# Altium project SerreVo_multiplexeur.PrjPcb
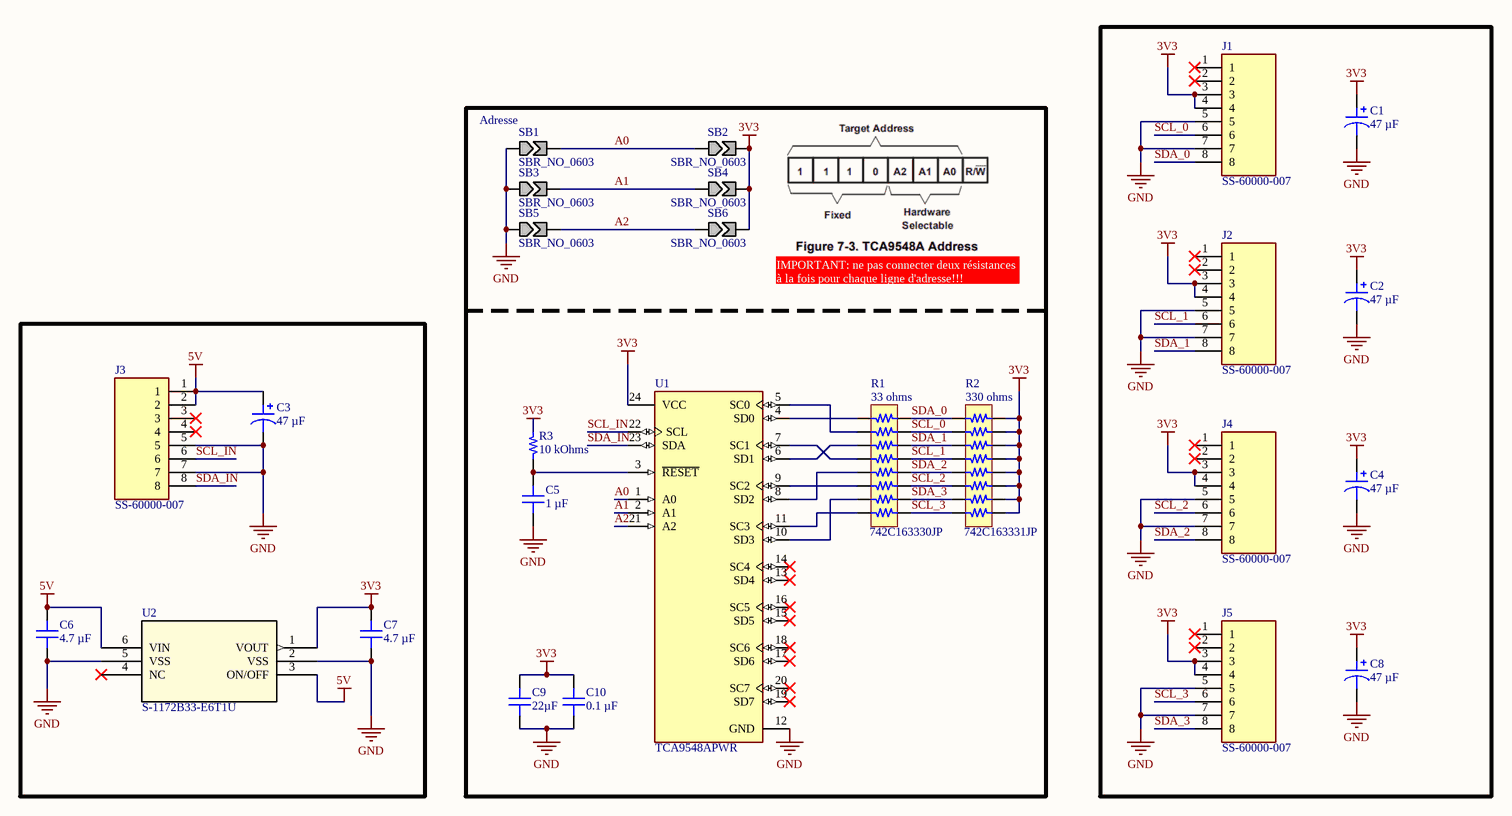
[diagram p0: TEMPLATE_Circuit.SchDoc]
Projet_Titre: SerrVo_multiplexeur; Projet_stencil_Top_epaisseur: 0.1 MM; Projet_stencil_Bot_epaisseur: 0.1 MM; Projet_SCH_Rev: 00; Projet_PCB_Rev: 1; Projet_nom_du_cours: Projet final; Projet_Date: 2025-02-04; Projet_Concepteur2: Jean-Christophe Chouinard; Projet_Concepteur1: Raphaël Gravel
1 sheet, 26 parts. Net scope: flat (ports and power ports of the same name join across sheets).
Board file: TEMPLATE_PCB_2L.PcbDoc

## Sheet TEMPLATE_Circuit.SchDoc
size Tabloid; Date: Date; Author: Author 1; Revision: 1; SheetNumber: 5; SheetTotal: 5; Size: 11x17; Sheet_Name: Circuit

### Parts
C1  47 µF  [CAP ALSMD 6.6MM H6.1MM]
C2  47 µF  [CAP ALSMD 6.6MM H6.1MM]
C3  47 µF  [CAP ALSMD 6.6MM H6.1MM]
C4  47 µF  [CAP ALSMD 6.6MM H6.1MM]
C5  1 µF  [CAP 0603_1608]
C6  4.7 µF  [CAP 0603_1608]
C7  4.7 µF  [CAP 0603_1608]
C8  47 µF  [CAP ALSMD 6.6MM H6.1MM]
C9  22µF  [CAP 0603_1608]
C10  0.1 µF  [CAP 0603_1608]
J1  SS-60000-007  [BEL_SS-60000-007]
J2  SS-60000-007  [BEL_SS-60000-007]
J3  SS-60000-007  [BEL_SS-60000-007]
J4  SS-60000-007  [BEL_SS-60000-007]
J5  SS-60000-007  [BEL_SS-60000-007]
R1  742C163330JP  [RESNET 2506-16 CONCAVE]
R2  742C163331JP  [RESNET 2506-16 CONCAVE]
R3  10 kOhms  [RES 0603_1608]
SB1  SBR_NO_0603  [0603_solderBridge_NO]  (no BOM)
SB2  SBR_NO_0603  [0603_solderBridge_NO]  (no BOM)
SB3  SBR_NO_0603  [0603_solderBridge_NO]  (no BOM)
SB4  SBR_NO_0603  [0603_solderBridge_NO]  (no BOM)
SB5  SBR_NO_0603  [0603_solderBridge_NO]  (no BOM)
SB6  SBR_NO_0603  [0603_solderBridge_NO]  (no BOM)
U1  TCA9548APWR  [FP-PW0024A-MFG]
U2  S-1172B33-E6T1U  [HSOP-6_FH006-A-P-SD-2.1_ABL]

### Nets
3V3: C1.1 C2.1 C4.1 C7.2 C8.1 C9.2 C10.2 J1.3 J1.4 J2.3 J2.4 J4.3 J4.4 J5.3 J5.4 R2.1 R2.2 R2.3 R2.4 R2.5 R2.6 R2.7 R2.8 R3.2 SB2.2 SB4.2 SB6.2 U1.24(VCC) U2.1(VOUT)
5V: C3.1 C6.2 J3.1 J3.2 U2.3(ON/OFF) U2.6(VIN)
GND: C1.2 C2.2 C3.2 C4.2 C5.1 C6.1 C7.1 C8.2 C9.1 C10.1 J1.5 J1.7 J2.5 J2.7 J3.5 J3.7 J4.5 J4.7 J5.5 J5.7 SB1.1 SB3.1 SB5.1 U1.12(GND) U2.2(VSS) U2.5(VSS)
A0: SB1.2 SB2.1 U1.1(A0)
A1: SB3.2 SB4.1 U1.2(A1)
A2: SB5.2 SB6.1 U1.21(A2)
SCL_0: J1.6 R1.2 R2.15
SCL_1: J2.6 R1.4 R2.13
SCL_2: J4.6 R1.6 R2.11
SCL_3: J5.6 R1.8 R2.9
SCL_IN: J3.6 U1.22(SCL)
SDA_0: J1.8 R1.1 R2.16
SDA_1: J2.8 R1.3 R2.14
SDA_2: J4.8 R1.5 R2.12
SDA_3: J5.8 R1.7 R2.10
SDA_IN: J3.8 U1.23(SDA)
NetC5_2: C5.2 R3.1 U1.3(~{RESET})
NetR1_9: R1.9 U1.11(SC3)
NetR1_10: R1.10 U1.10(SD3)
NetR1_11: R1.11 U1.9(SC2)
NetR1_12: R1.12 U1.8(SD2)
NetR1_13: R1.13 U1.7(SC1)
NetR1_14: R1.14 U1.6(SD1)
NetR1_15: R1.15 U1.5(SC0)
NetR1_16: R1.16 U1.4(SD0)

Not connected (* = marked no-connect by the designer): J1 1* 2*; J2 1* 2*; J3 3* 4*; J4 1* 2*; J5 1* 2*; U1 13(SD4)* 14(SC4)* 15(SD5)* 16(SC5)* 17(SD6)* 18(SC6)* 19(SD7)* 20(SC7)*; U2 4(NC)*

### Notes on the sheet
- (near SB1) Adresse
- (near SB6) IMPORTANT: ne pas connecter deux résistances à la fois pour chaque ligne d'adresse!!!
- (near R1) 33 ohms
- (near R2) 330 ohms
- Nom de la feuille
- Titre du projet
- Cours associé au projet
- Taille
- Département
- Technologies du
- Révision
- PCB
- .
- SCH
- Date
- génie électrique
- Feuille
- Variant
- de
- Concepteurs

### Library data of the parts
C1-C4 C8 = 476SML035M: CAP ALUM 47UF 20% 35V SMD; manufacturer: Cornell Dubilier / Illinois Capacitor; ESR (Equivalent Series Resistance): 4.938Ohm @ 120Hz; Lifetime @ Temp.: 2000 Hrs @ 85°C; Polarization: Polar; Ripple Current @ High Frequency: 105 mA @ 100 kHz; Ripple Current @ Low Frequency: 70 mA @ 120 Hz; Surface Mount Land Size: 0.260" L x 0.260" W (6.60mm x 6.60mm); Part Number: 476SML035M; Applications: Bypass, Decoupling; Capacitance: 47 µF; componentlink1description: Datasheet; componentlink1url: https://www.cde.com/resources/catalogs/SML.pdf; componentlink2description: DigiKey Link; componentlink2url: https://www.digikey.com/en/products/detail/cornell-dubilier-illinois-capacitor/476SML035M/6141144; Height - Seated (Max): 0.240" (6.10mm); lastupdated: 2024-06-03 20:16:08; Lifecycle Status: Active; Minimum Order: 1; Mounting Type: Surface Mount; Operating Temperature: -40°C ~ 85°C; packaging: Bulk; partid: 27879; Part Status: Active; price: 0.08; series: SML; Size / Dimension: 0.248" Dia (6.30mm); Supplier 1: DigiKey; Supplier Part Number 1: 1572-476SML035MCT-ND; Tolerance: ±20%; value: 47 µF; Voltage - Rated: 35 V
C5 = C0603X105M4RACAUTO: CAP CER 1UF 16V X7R 0603; manufacturer: KEMET; Tolerance: ±20%; Part Number: C0603X105M4RACAUTO; Value: 1 µF; Applications: Automotive, Boardflex Sensitive; Capacitance: 1 µF; componentlink1description: Datasheet; componentlink1url: https://api.kemet.com/component-edge/download/datasheet/C0603X105M4RACAUTO.pdf; componentlink2description: DigiKey Link; componentlink2url: https://www.digikey.com/en/products/detail/kemet/C0603X105M4RACAUTO/8635846; Device Package: 0603 (1608 Metric); Features: Soft Termination; lastupdated: 2024-02-09 20:10:28; Lifecycle Status: Active; Minimum Order: 1; Mounting Type: Surface Mount, MLCC; Operating Temperature: -55°C ~ 125°C; Package / Case: 0603 (1608 Metric); packaging: TapeAndReel; partid: 3927; Part Status: Active; price: 0.06; Ratings: AEC-Q200; series: SMD Auto X7R Flex; Size / Dimension: 0.063" L x 0.031" W (1.60mm x 0.80mm); Supplier 1: DigiKey; Supplier Part Number 1: 399-17719-1-ND; Temperature Coefficient: X7R; Thickness (Max): 0.037" (0.95mm); Voltage - Rated: 16V
C6 C7 = CL10A475KA8NQNC: CAP CER 4.7UF 25V X5R 0603; manufacturer: Samsung Electro-Mechanics; Tolerance: ±10%; Part Number: CL10A475KA8NQNC; Value: 4.7 µF; Applications: General Purpose; Capacitance: 4.7 µF; componentlink1description: Datasheet; componentlink1url: http://www.samsungsem.com/kr/support/product-search/mlcc/CL10A475KA8NQNC.jsp; componentlink2description: DigiKey Link; componentlink2url: https://www.digikey.com/en/products/detail/samsung-electro-mechanics/CL10A475KA8NQNC/3887558; Device Package: 0603 (1608 Metric); lastupdated: 2024-02-09 20:10:30; Lifecycle Status: Active; Minimum Order: 1; Mounting Type: Surface Mount, MLCC; Operating Temperature: -55°C ~ 85°C; Package / Case: 0603 (1608 Metric); packaging: TapeAndReel; partid: 2349; Part Status: Active; price: 0.06; series: CL; Size / Dimension: 0.063" L x 0.031" W (1.60mm x 0.80mm); Supplier 1: DigiKey; Supplier Part Number 1: 1276-1900-1-ND; Temperature Coefficient: X5R; Thickness (Max): 0.035" (0.90mm); Voltage - Rated: 25V
C9 = 06036D226MAT2A: CAP CER 22UF 6.3V X5R 0603; manufacturer: AVX Corporation; Tolerance: ±20%; Part Number: 06036D226MAT2A; Value: 22µF; Applications: General Purpose; Capacitance: 22µF; componentlink1description: Datasheet; componentlink1url: http://datasheets.avx.com/cx5r.pdf; componentlink2description: DigiKey Link; componentlink2url: http://digikey.com/product-detail/en/avx-corporation/06036D226MAT2A/478-10812-1-ND/7536349; Device Package: 0603 (1608 Metric); lastupdated: 2020-09-02 01:03:16; Lifecycle Status: Active; Minimum Order: 1; Mounting Type: Surface Mount, MLCC; Operating Temperature: -55°C ~ 85°C; Package / Case: 0603 (1608 Metric); packaging: TapeAndReel; partid: 13180; Part Status: Active; price: 0.10; series: -; Size / Dimension: 0.063" L x 0.032" W (1.60mm x 0.81mm); Supplier 1: DigiKey; Supplier Part Number 1: 478-10812-1-ND; Temperature Coefficient: X5R; Thickness (Max): 0.040" (1.02mm); Voltage - Rated: 6.3V
C10 = C0603C104M4RAC7411: CAP CER 0.1UF 16V X7R 0603; manufacturer: KEMET; Tolerance: ±20%; Part Number: C0603C104M4RAC7411; Value: 0.1 µF; Applications: Bypass, Decoupling; Capacitance: 0.1 µF; componentlink1description: Datasheet; componentlink1url: https://api.kemet.com/component-edge/download/datasheet/C0603C104M4RAC7411.pdf; componentlink2description: DigiKey Link; componentlink2url: https://www.digikey.com/en/products/detail/kemet/C0603C104M4RAC7411/1865802; Device Package: 0603 (1608 Metric); lastupdated: 2024-02-09 20:10:25; Lifecycle Status: Active; Minimum Order: 15000; Mounting Type: Surface Mount, MLCC; Operating Temperature: -55°C ~ 125°C; Package / Case: 0603 (1608 Metric); packaging: TapeAndReel; partid: 6660; Part Status: Active; price: 0.01; series: SMD Comm X7R; Size / Dimension: 0.063" L x 0.031" W (1.60mm x 0.80mm); Supplier 1: DigiKey; Supplier Part Number 1: 399-5784-2-ND; Temperature Coefficient: X7R; Thickness (Max): 0.034" (0.87mm); Voltage - Rated: 16V
J1-J5 = SS-60000-007: Jack Modular Connector 8p8c _RJ45, Ethernet_ Vertical Unshielded Cat6; MF: Stewart Connector; Value: *; Digi-Key_Part_Number: 380-1094-5-ND; Package: None; SnapEDA_Link: https://www.snapeda.com/parts/SS-60000-007/Stewart%20Connector/view-part/2842197/?ref=snap; Digi-Key_Purchase_URL: https://www.digikey.ca/product-detail/en/stewart-connector/SS-60000-007/380-1094-5-ND/1033361?utm_source=snapeda&utm_medium=aggregator&utm_campaign=symbol; MP: SS-60000-007
R1 = 742C163330JP: RES ARRAY 8 RES 33 OHM 2506; Manufacturer: CTS Resistor Products; Circuit Type: Isolated; Number of Resistors: 8; Power Per Element: 63mW; Resistance (Ohms): 33; Temperature Coefficient: ±200ppm/°C; Tolerance: ±5%; Part Number: 742C163330JP; Applications: DDR SDRAM, DRAM, MDDR; ComponentLink1Description: Datasheet; ComponentLink1URL: https://www.ctscorp.com/wp-content/uploads/74x.pdf; ComponentLink2Description: DigiKey Link; ComponentLink2URL: https://www.digikey.com/en/products/detail/cts-resistor-products/742C163330JP/1124343; Height - Seated (Max): 0.028" (0.70mm); LastUpdated: 2024-06-03 20:04:15; Lifecycle Status: Active; Minimum Order: 1; Mounting Type: Surface Mount; Number of Pins: 16; Operating Temperature: -55°C ~ 125°C; Package / Case: 2506, Concave, Long Side Terminals; Packaging: TapeAndReel; PartId: 24; Part Status: Active; Price: 0.08; Series: 742; Size / Dimension: 0.252" L x 0.063" W (6.40mm x 1.60mm); Supplier 1: DigiKey; Supplier Part Number 1: 742C163330JPCT-ND
R2 = 742C163331JP: RES ARRAY 8 RES 330 OHM 2506; Manufacturer: CTS Resistor Products; Circuit Type: Isolated; Number of Resistors: 8; Power Per Element: 63mW; Resistance (Ohms): 330; Temperature Coefficient: ±200ppm/°C; Tolerance: ±5%; Part Number: 742C163331JP; Applications: DDR SDRAM, DRAM, MDDR; ComponentLink1Description: Datasheet; ComponentLink1URL: https://www.ctscorp.com/wp-content/uploads/74x.pdf; ComponentLink2Description: DigiKey Link; ComponentLink2URL: https://www.digikey.com/en/products/detail/cts-resistor-products/742C163331JP/1124342; Height - Seated (Max): 0.028" (0.70mm); LastUpdated: 2024-06-03 20:04:15; Lifecycle Status: Active; Minimum Order: 1; Mounting Type: Surface Mount; Number of Pins: 16; Operating Temperature: -55°C ~ 125°C; Package / Case: 2506, Concave, Long Side Terminals; Packaging: TapeAndReel; PartId: 23; Part Status: Active; Price: 0.07; Series: 742; Size / Dimension: 0.252" L x 0.063" W (6.40mm x 1.60mm); Supplier 1: DigiKey; Supplier Part Number 1: 742C163331JPCT-ND
R3 = RCS060310K0JNEA: RES SMD 10K OHM 5% 1/4W 0603; Manufacturer: Vishay Dale; Power (Watts): 0.25W, 1/4W; Temperature Coefficient: ±200ppm/°C; Part Number: RCS060310K0JNEA; Value: 10 kOhms; ComponentLink1Description: Datasheet; ComponentLink1URL: http://www.vishay.com/docs/20065/rcse3.pdf; ComponentLink2Description: DigiKey Link; ComponentLink2URL: https://www.digikey.com/en/products/detail/vishay-dale/RCS060310K0JNEA/5866963; Composition: Thick Film; Device Package: 0603 (1608 Metric); Features: Automotive AEC-Q200, Pulse Withstanding; Height - Seated (Max): 0.020" (0.50mm); LastUpdated: 2024-02-09 20:43:35; Lifecycle Status: Active; Minimum Order: 1; Number of Terminations: 2; Operating Temperature: -55°C ~ 155°C; Package / Case: 0603 (1608 Metric); Packaging: TapeAndReel; PartId: 5383; Part Status: Active; Price: 0.01; Ratings: AEC-Q200; Resistance: 10 kOhms; Series: RCS e3; Size / Dimension: 0.061" L x 0.033" W (1.55mm x 0.85mm); Supplier 1: DigiKey; Supplier Part Number 1: 541-2817-1-ND; Supplier Device Package: 0603; Tolerance: ±5%
SB1-SB6 = CMP-005-000007-1: Solder Bridge 0603 NO; ComponentLink2URL: http://digikey.com/product-detail/en/broadcom-limited/ASMT-QHBD-AFH0E/516-2951-1-ND/4240266; Voltage rating: N/A; ComponentLink2Description: DigiKey Link; Tolerance: *; ComponentLink1URL: https://docs.broadcom.com/docs/AV02-1841EN; ComponentLink3URL: *; Assembly Type: N/A; Source: macro_keyboard_TEMP_LIB.SchLib; Value: N/A; Design Item ID: SBR_NO_0603; ComponentLink3Description: New link; ComponentLink1Description: Datasheet; Package / Case: 0603
U1 = CMP-04892-000002-1: IC I2C SW 8CH W/RESET 24TSSOP; Manufacturer: Texas Instruments; Number Of Circuits: 1; Mux Demux Ratio: 1:8; Nominal Supply Current: 2-50uA; Interface: I2C,SMBus; Min Supply Voltage: 1.65V; Standoff Height: 0.05mm; Max Supply Voltage: 5.5V; Device Class L2: Interface ICs; ComponentLink2Description: Datasheet; Ipc Land Pattern Name: SOP65P640X120-24; Category: IC; Device Class L1: Integrated Circuits (ICs); Manufacturer Part Number: TCA9548APWR; RoHS: TRUE; Temperature Range High: +85°C; Digikey Description: IC I2C SW 8CH W/RESET 24TSSOP; Temperature Range Low: -40°C; Lead Free: Yes; Package: PW0024A; ComponentLink2URL: http://www.ti.com/lit/ds/symlink/tca9548a.pdf; Device Class L3: Multiplexers; Ambient Temperature Range Low: -40°C; Mouser Description: Low-Voltage 8-Channel I2C Switch With Reset 24-TSSOP -40 to 85; Temperature: -40°C to +85°C; Octopart: https://octopart.com/tca9548apwr-texas+instruments-22266789; Ambient Temperature Range High: +85°C; Automotive: No; Height: 1.2mm
U2 = S-1172B33-E6T1U: No Description Available; Mfr_Name: ABLIC; RefDes: RefDes; Type: Type